# EAGLE schematic RGBLEDv1 (EAGLE 6.4)
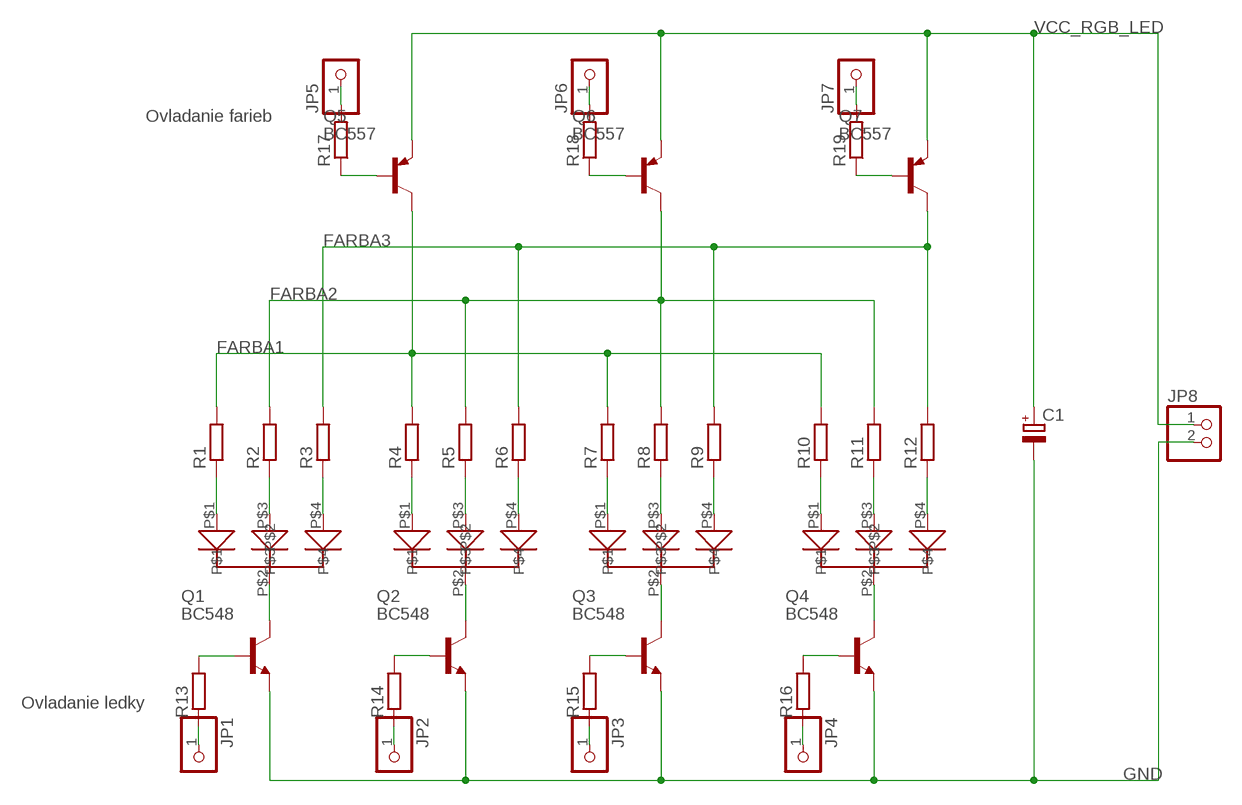
[diagram p0: schematic, sheet 1]

## Parts
C1  CPOL-EUE2.5-7  [E2,5-7]
JP1  PINHD-1X1  [1X01]
JP2  PINHD-1X1  [1X01]
JP3  PINHD-1X1  [1X01]
JP4  PINHD-1X1  [1X01]
JP5  PINHD-1X1  [1X01]
JP6  PINHD-1X1  [1X01]
JP7  PINHD-1X1  [1X01]
JP8  PINHD-1X2  [1X02]
Q1  BC548  [TO92-EBC]
Q2  BC548  [TO92-EBC]
Q3  BC548  [TO92-EBC]
Q4  BC548  [TO92-EBC]
Q5  BC557  [TO92]
Q6  BC557  [TO92]
Q7  BC557  [TO92]
R1  R-EU_0207/10  [0207/10]
R2  R-EU_0207/10  [0207/10]
R3  R-EU_0207/10  [0207/10]
R4  R-EU_0207/10  [0207/10]
R5  R-EU_0207/10  [0207/10]
R6  R-EU_0207/10  [0207/10]
R7  R-EU_0207/10  [0207/10]
R8  R-EU_0207/10  [0207/10]
R9  R-EU_0207/10  [0207/10]
R10  R-EU_0207/10  [0207/10]
R11  R-EU_0207/10  [0207/10]
R12  R-EU_0207/10  [0207/10]
R13  R-EU_0207/10  [0207/10]
R14  R-EU_0207/10  [0207/10]
R15  R-EU_0207/10  [0207/10]
R16  R-EU_0207/10  [0207/10]
R17  R-EU_0207/10  [0207/10]
R18  R-EU_0207/10  [0207/10]
R19  R-EU_0207/10  [0207/10]
RGBLED1  RGBLED  [RGBLED]
RGBLED2  RGBLED  [RGBLED]
RGBLED3  RGBLED  [RGBLED]
RGBLED4  RGBLED  [RGBLED]

## Nets
FARBA1: Q5.3(C) R1.2 R4.2 R7.2 R10.2
FARBA2: Q6.3(C) R2.2 R5.2 R8.2 R11.2
FARBA3: Q7.3(C) R3.2 R6.2 R9.2 R12.2
GND: C1.- JP8.2 Q1.E Q2.E Q3.E Q4.E
N$1: R1.1 RGBLED1.P$1
N$2: R2.1 RGBLED1.P$3
N$3: R3.1 RGBLED1.P$4
N$4: R4.1 RGBLED2.P$1
N$5: R5.1 RGBLED2.P$3
N$6: R6.1 RGBLED2.P$4
N$7: R7.1 RGBLED3.P$1
N$8: R8.1 RGBLED3.P$3
N$9: R9.1 RGBLED3.P$4
N$10: R10.1 RGBLED4.P$1
N$11: R11.1 RGBLED4.P$3
N$12: R12.1 RGBLED4.P$4
N$13: Q1.C RGBLED1.P$2
N$14: Q2.C RGBLED2.P$2
N$15: Q3.C RGBLED3.P$2
N$16: Q4.C RGBLED4.P$2
N$17: JP1.1 R13.1
N$18: Q1.B R13.2
N$19: Q2.B R14.2
N$20: Q3.B R15.2
N$21: Q4.B R16.2
N$22: JP2.1 R14.1
N$23: JP3.1 R15.1
N$24: JP4.1 R16.1
N$28: Q5.2(B) R17.1
N$29: Q6.2(B) R18.1
N$30: Q7.2(B) R19.1
N$32: JP5.1 R17.2
N$33: JP6.1 R18.2
N$34: JP7.1 R19.2
VCC_RGB_LED: C1.+ JP8.1 Q5.1(E) Q6.1(E) Q7.1(E)

## Notes on the sheet
- Ovladanie farieb
- Ovladanie ledky

## Library data of the parts
C1 = resistor:CPOL-EU: POLARIZED CAPACITOR, European symbol
JP1-JP7 = pinhead:PINHD-1X1: PIN HEADER
JP8 = pinhead:PINHD-1X2: PIN HEADER
Q1-Q4 = transistor-npn:BC548*: NPN Transistor
Q5-Q7 = transistor-pnp:BC557: PNP Transistor
R1-R19 = resistor:R-EU_: RESISTOR, European symbol
RGBLED1-RGBLED4 = RGBLed:RGBLED